# Altium schematic sheet RTC.SchDoc
size A4; PageSetup: Record=PageOptions|CenterHorizontal=True|CenterVertical=True|PrintScale=0.99|XCorrection=1.00|YCorrection=1.00|PrintKind=1|BorderSize=5000000|LeftOffset=0|BottomOffset=0|Orientation=1|PaperLength=1000|PaperWidth=1000|Scale=100|PaperSource=15|PrintQuality=600|MediaType=1|DitherType=10|PrintScaleMode=1|PaperKind=A4|PaperIndex=9
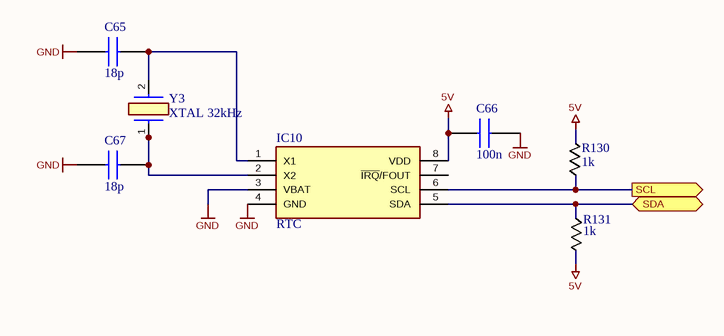
[diagram p0: RTC.SchDoc]

## Parts
C65  18p  [0603 CAP]
C66  100n  [0603 CAP]
C67  18p  [0603 CAP]
IC10  RTC  [SOIC-8]
R130  1k  [0603 CAP]
R131  1k  [0603 CAP]
Y3  XTAL 32kHz  [NX32 kHz]

## Ports
SCL, SDA

## Nets
5V: C66.2 IC10.8(VDD) R130.2 R131.2
GND: C65.1 C66.1 C67.1 IC10.3(VBAT) IC10.4(GND)
SCL: IC10.6(SCL) R130.1 ; port SCL
SDA: IC10.5(SDA) R131.1 ; port SDA
NetC65_2: C65.2 IC10.1(X1) Y3.2
NetC67_2: C67.2 IC10.2(X2) Y3.1

Not connected (* = marked no-connect by the designer): IC10 7(~{IRQ}/FOUT)

## Library data of the parts
C65 C67 = 0603 CAP: CC0603JRNPO9BN180; Manufacturer_Name: Murata Electronics; Manufacturer_Part_Number: GRM188R72A103KA01D; Datasheet Link: https://search.murata.co.jp/Ceramy/image/img/A01X/G101/ENG/GRM188R72A103KA01-01A.pdf; Height: 0.9mm; Mouser Part Number: 81-GRM188R72A103KA1D; Mouser Price/Stock: https://www.mouser.co.uk/ProductDetail/Murata-Electronics/GRM188R72A103KA01D?qs=krk%2F6UQjCzAtl9phuocbug%3D%3D; Arrow Part Number: GRM188R72A103KA01D; Arrow Price/Stock: https://www.arrow.com/en/products/grm188r72a103ka01d/murata-manufacturing?region=europe
C66 = 0603 CAP: CC0603KRX7R9BB104; Manufacturer_Name: Murata Electronics; Manufacturer_Part_Number: GRM188R72A103KA01D; Datasheet Link: https://search.murata.co.jp/Ceramy/image/img/A01X/G101/ENG/GRM188R72A103KA01-01A.pdf; Height: 0.9mm; Mouser Part Number: 81-GRM188R72A103KA1D; Mouser Price/Stock: https://www.mouser.co.uk/ProductDetail/Murata-Electronics/GRM188R72A103KA01D?qs=krk%2F6UQjCzAtl9phuocbug%3D%3D; Arrow Part Number: GRM188R72A103KA01D; Arrow Price/Stock: https://www.arrow.com/en/products/grm188r72a103ka01d/murata-manufacturing?region=europe
IC10 = ISL1208IB8Z: ISL1208IB8Z-TK; Manufacturer_Name: Renesas Electronics; Datasheet Link: https://www.renesas.com/en-us/www/doc/datasheet/isl1208.pdf; Height: 1.75mm; Manufacturer_Part_Number: ISL1208IB8Z; Mouser Part Number: 968-ISL1208IB8Z; Mouser Price/Stock: https://www.mouser.co.uk/ProductDetail/Renesas-Intersil/ISL1208IB8Z?qs=9fLuogzTs8IV4a5aC7pqiA%3D%3D; Arrow Part Number: ISL1208IB8Z; Arrow Price/Stock: https://www.arrow.com/en/products/isl1208ib8z/intersil
R130 R131 = 0603 RES
Y3 = XTAL 32kHz: Crystal or Oscillator; Manufacturer_Name: NDK; Manufacturer_Part_Number: NX3215SA-32.768K-STD-MUA-14; Datasheet Link: https://www.mouser.com/datasheet/2/905/c_NX3215SA-STD-MUA-14_e-1317539.pdf; Height: 0.9mm; Mouser Part Number: 344-NX3215SA32768K14; Mouser Price/Stock: https://www.mouser.co.uk/ProductDetail/NDK/NX3215SA-32.768K-STD-MUA-14?qs=55YtniHzbhCTyKGENMTVrQ%3D%3D